# Altium schematic sheet Sheet_POWER_SUPPL.SchDoc
size A4; SheetNumber: 4; SheetTotal: 6
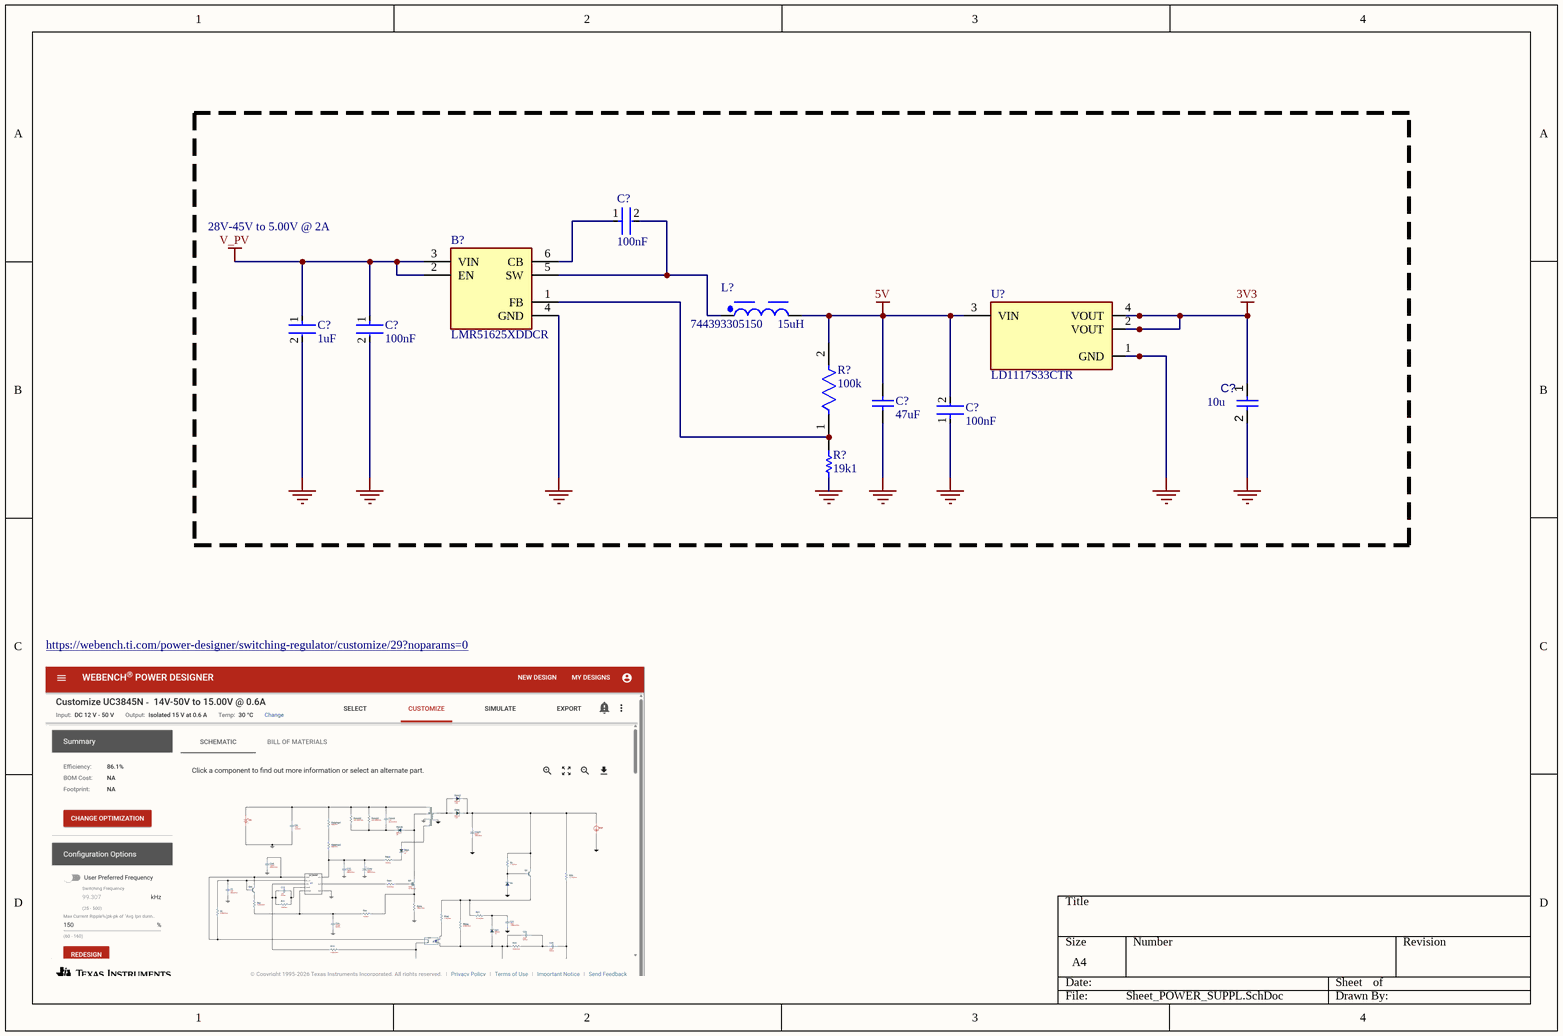
[diagram p0: Sheet_POWER_SUPPL.SchDoc]

## Parts
(Parts that share a designator on the sheet are numbered #1, #2 ... from top to bottom, then left to right.)
B?  LMR51625XDDCR  [SOT95P280X110-6N]
C?#1  100nF  [FP-GCM21B-0_15-MFG]
C?#2  1uF  [FP-C2012-125-IPC_B]
C?#3  100nF  [FP-GCM21B-0_15-MFG]
C?#4  value 10u  [CAPC2013X95X50LL10T25]  (hidden comment: Capacitor 100 nF +/-10% 50 V 0805)
C?#5  47uF  [CAPC0805(2012)145_N]
C?#6  100nF  [FP-GCM21B-0_15-MFG]
L?  744393305150     15uH  [WE-XHMI_5050]
R?#1  100k  [FP-CRCW0805-e3-IPC_A]
R?#2  19k1  [RESC0805(2012)_M]
U?  LD1117S33CTR  [FP-SOT-223-0046067_14-MFG]

## Blocks framed on the sheet
28V-45V to 5.00V @ 2A: B? C?#1-C?#6 L? R?#1 R?#2 U?

## Nets
3V3: C?#4.1 U?.2(VOUT) U?.4(VOUT)
5V: C?#5.2 C?#6.2 L?.2 R?#1.2 U?.3(VIN)
GND: B?.4(GND) C?#2.2 C?#3.2 C?#4.2 C?#5.1 C?#6.1 R?#2.1 U?.1(GND)
V_PV: B?.2(EN) B?.3(VIN) C?#2.1 C?#3.1
NetB?_1: B?.1(FB) R?#1.1 R?#2.2
NetB?_5: B?.5(SW) C?#1.2 L?.1
NetB?_6: B?.6(CB) C?#1.1

## Notes on the sheet
- https://webench.ti.com/power-designer/switching-regulator/customize/29?noparams=0

## Library data of the parts
B? = LMR51625XDDCR: Switching Voltage Regulators SIMPLE SWITCHER synchronous buck converter with 4.3V-to-60V, 2.5A and low quiescent current; Manufacturer_Name: Texas Instruments; Geometry.Height: 1.1mm; Manufacturer_Part_Number: LMR51625XDDCR; Mouser Part Number: 595-LMR51625XDDCR; Mouser Price/Stock: https://www.mouser.co.uk/ProductDetail/Texas-Instruments/LMR51625XDDCR?qs=efUn273yAheKjJQ13bmSQQ%3D%3D; Arrow Part Number: LMR51625XDDCR; Arrow Price/Stock: https://www.arrow.com/en/products/lmr51625xddcr/texas-instruments?utm_currency=USD&region=nac; Datasheet Link: https://www.ti.com/lit/ds/symlink/lmr51625.pdf?ts=1740555768028
C?#1 C?#3 C?#6 = CMP-2007-03364-2: Ceramic Capacitor for Automotive 100nF ±10% 100VDC X7R 0805 Embossed T/R; Voltage Rating: 100V; Termination: SMD/SMT; Tolerance: 10%; Case Code (Imperial): 0805; Length: 2mm; Max Operating Temperature: 125°C; Case/Package: 0805; Mount: Surface Mount; Packaging: Tape and Reel; Package Quantity: 1; Min Operating Temperature: -55°C; Case Code (Metric): 2012; Radiation Hardening: No; REACH SVHC: No SVHC; Dielectric: X7R; Depth: 1.25mm; Lead Free: Lead Free; Ratings: AEC-Q200; Height: 1.25mm; Voltage: 100V; Capacitance: 100nF; Voltage Rating (DC): 100V; Width: 0.049inch; Thickness: 0.055inch
C?#2 = CMP-08246-004333-1: CAP CER 1UF 100V X7S 0805; Tolerance: 10%; Case Code (Metric): 2012; Resistor Type: Ceramic; Voltage Rating (DC): 100V; RoHS Compliant: Yes; Mount: Surface Mount; Min Operating Temperature: -55°C; Voltage Rating: 100V; Series: C; Width: 0.05inch; Max Operating Temperature: 125°C; Height: 1.25mm; Capacitance: 1uF; Length: 2mm; Dielectric: X7S; Case/Package: 0805; Packaging: Tape and Reel; Features: Soft Termination; Lead Free: Lead Free; Case Code (Imperial): 0805; Thickness: 0.049inch; Termination: SMD/SMT; Package Quantity: 1; Depth: 1.25mm
C?#4 = CMP-001-00018-6: Chip Capacitor, 100 nF, +/- 10%, 50 V, 0805 (2012 Metric); Capacitor Type: Ceramic; Voltage Rating: 50V; Pins: 2; Max Operating Temperature: 125°C; Min Operating Temperature: -55°C; Mounting Technology: SM; Case/Package: 0805; RoHS Compliant: True; Tolerance: 10%
C?#5 = CMP-1036-04950-1: CAP 47uF 6.3V ±20% 0805 (2012 Metric) Thickness 1.45mm SMD; Case-EIA: 0805; Case-Metric: 2012; Tolerance: Â±20%; Technology: SMT; Value: 47uF; Max Thickness: 1.45 mm; Rated Voltage: 6.3 V
L? = CMP-03913-148605666-1: Power Inductor, 15UH, Shielded, 4A Rohs Compliant: Yes
R?#1 = CMP-02407-006346-1: RES Thick Film, 100kΩ, 1%, 0.125W, 100ppm/°C, 0805; Resistance: 100kR; Max Power Dissipation: 125mW; Max Operating Temperature: 155°C; Lead Free: Lead Free; Temperature Coefficient: 100ppm/°C; Radiation Hardening: No; Military Standard: Not; Height: 0.02inch; Contact Plating: Tin; Length: 0.079inch; Tolerance: 1%; Composition: Thick Film; Case/Package: 0805; Package Quantity: 20000; Width: 0.049inch; Depth: 1.25mm; Features: Automotive AEC-Q200; Number of Terminations: 2; Packaging: Tape and Reel; Min Operating Temperature: -55°C
R?#2 = CMP-1013-00653-1: 19K1 0.125W 1% 0805 (2012 Metric)  SMD; Value: 19100.00 Ohm; Case-EIA: 0805; Case-Metric: 2012; Power: 0.125 W; Tolerance: 1 %; Technology: SMT
U? = CMP-0244-00307-2: IC REG LINEAR 3.3V 800MA SOT223; Input Bias Current: 5mA; Output Voltage Accuracy: 1%; Dropout Voltage: 1.1V; Power Dissipation: 12W; Polarity: Positive; Min Input Voltage: 5.3V; Quiescent Current: 10mA; Max Output Current: 1.3A; Output Current: 950mA; Number of Regulators: 1; Max Supply Voltage: 15V; Output Type: Fixed; Output Voltage: 3.3V; Number of Terminals: 4; Min Supply Voltage: 3.3V; Termination: SMD/SMT; Mount: Surface Mount; Max Power Dissipation: 12W; Case/Package: SOT-223; Lead Free: Lead Free; Height: 1.8mm; REACH SVHC: No SVHC; Radiation Hardening: No; Width: 3.5mm; Length: 6.5mm; Packaging: Tape and Reel; Max Input Voltage: 15V; Accuracy: 1%; Weight: 0.01lb; Contact Plating: Tin; Max Operating Temperature: 125°C; Number of Pins: 4; Max Output Voltage: 3.3V; Min Operating Temperature: -40°C; Nominal Output Voltage: 3.3V; Package Quantity: 1; Min Output Voltage: 3.3V; Number of Outputs: 1